# Altium schematic sheet 04_Mechanical.SchDoc: Mechanicals
size A; Revision: A; SheetNumber: 4; SheetTotal: 4; ECE315_Project_Name: ECE453 Base Project
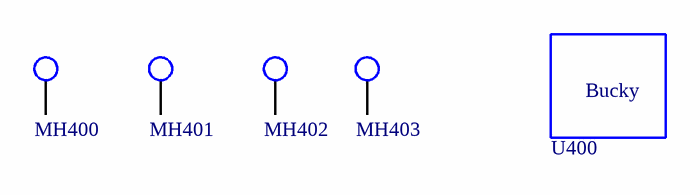
[diagram p0: 04_Mechanical.SchDoc]

## Parts
MH400  MHOLE_2_55MM  [MHOLE_2_55MM]  (value not drawn)
MH401  MHOLE_2_55MM  [MHOLE_2_55MM]  (value not drawn)
MH402  MHOLE_2_55MM  [MHOLE_2_55MM]  (value not drawn)
MH403  MHOLE_2_55MM  [MHOLE_2_55MM]  (value not drawn)
U400  Bucky  [WalkingBucky]  (value not drawn)  (no BOM)

## Nets

Not connected (* = marked no-connect by the designer): MH400 1; MH401 1; MH402 1; MH403 1

## Notes on the sheet
- Title:
- Size:
- A
- Project
- Rev:
- Sheet:
- of
- College of Engineering
- 1415 Engineering Drive
- Madison, WI 53706

## Library data of the parts
MH400-MH403 = MHOLE_2_55MM: Mounting Holde; Manufacturer Part Number: UW MTHOLE
U400 = Bucky: Bucky Badger Image; Manufacturer Part Number: UW Bucky